# EAGLE design ESPswitch (EAGLE 9.3.0)
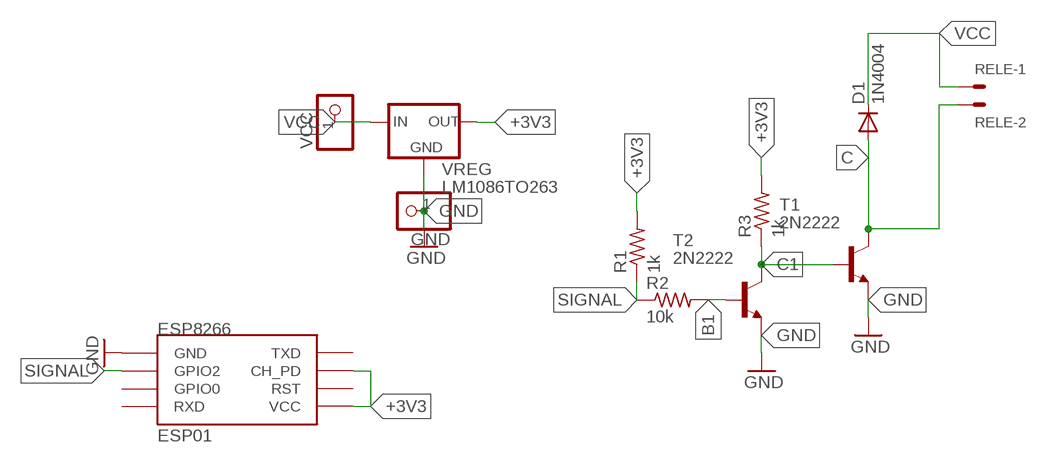
[diagram p0: schematic, sheet 1]

## Parts
D1  1N4004  [DO41-10]
ESP8266  ESP01  [ESP01]
GND  PINHD-1X1  [1X01]
R1  1k  R-US_0309/12  [0309/12]
R2  10k  R-US_0309/12  [0309/12]
R3  1k  R-US_0309/12  [0309/12]
RELE  22-23-2021  [22-23-2021]
T1  2N2222  [TO92-EBC-OVAL]
T2  2N2222  [TO92-EBC-OVAL]
VCC  PINHD-1X1  [1X01]
VREG  LM1086TO263  [TO263]

## Nets
+3V3: ESP8266.CH_PD ESP8266.VCC R1.2 R3.2 VREG.2(OUT)
B1: R2.2 T2.B
C: D1.A RELE.2 T1.C
C1: R3.1 T1.B T2.C
GND: ESP8266.GND GND.1 T1.E T2.E VREG.1(GND)
SIGNAL: ESP8266.GPIO2 R1.1 R2.1
VCC: D1.C RELE.1 VCC.1 VREG.3(IN)
Unconnected: ESP8266.GPIO0 ESP8266.RST ESP8266.RX(RXD) ESP8266.TX(TXD)

## Library data of the parts
D1 = adafruit:1N4004: DIODE General purpose 1N400x type rectifier (With bigger pads) http://www.ladyada.net/library/pcb/eaglelibrary.html
ESP8266 = esp8266modules:ESP01: ESP8266 Wifi module 01
GND VCC = adafruit:PINHD-1X1: Pin header 1x1 for 0.1" spacing With round pins
R1-R3 = rcl:R-US_: RESISTOR, American symbol; SPICEPREFIX: R
RELE = con-molex:22-23-2021: .100" (2.54mm) Center Header - 2 Pin; MF: MOLEX; MPN: 22-23-2021; OC_FARNELL: 1462926; OC_NEWARK: 25C3832
T1 T2 = adafruit:2N2222: NPN TRANSISTOR Big oval pads
VREG = v-reg-2:LM1086

## Board
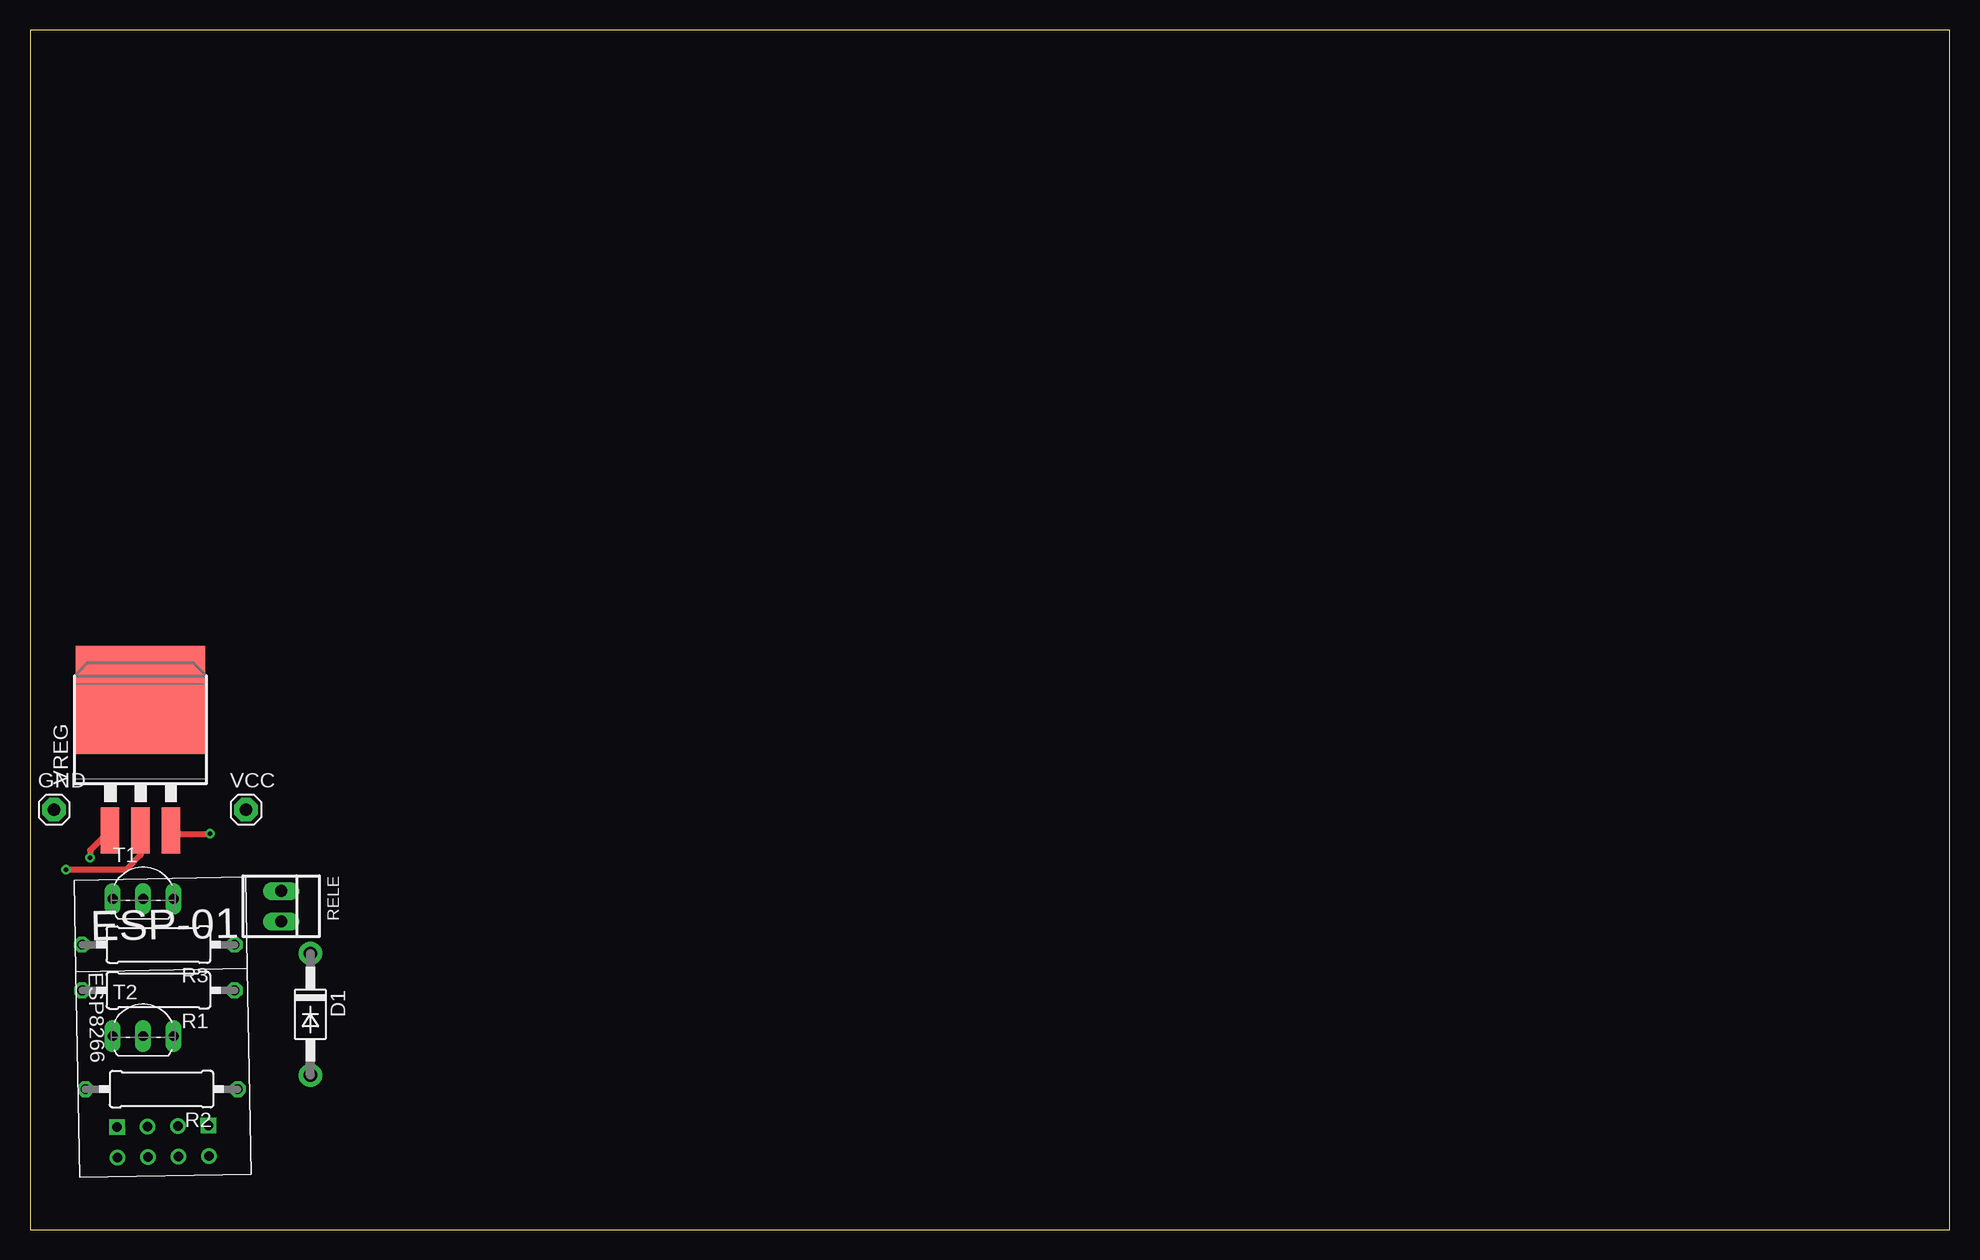
[diagram p1: board, top side]
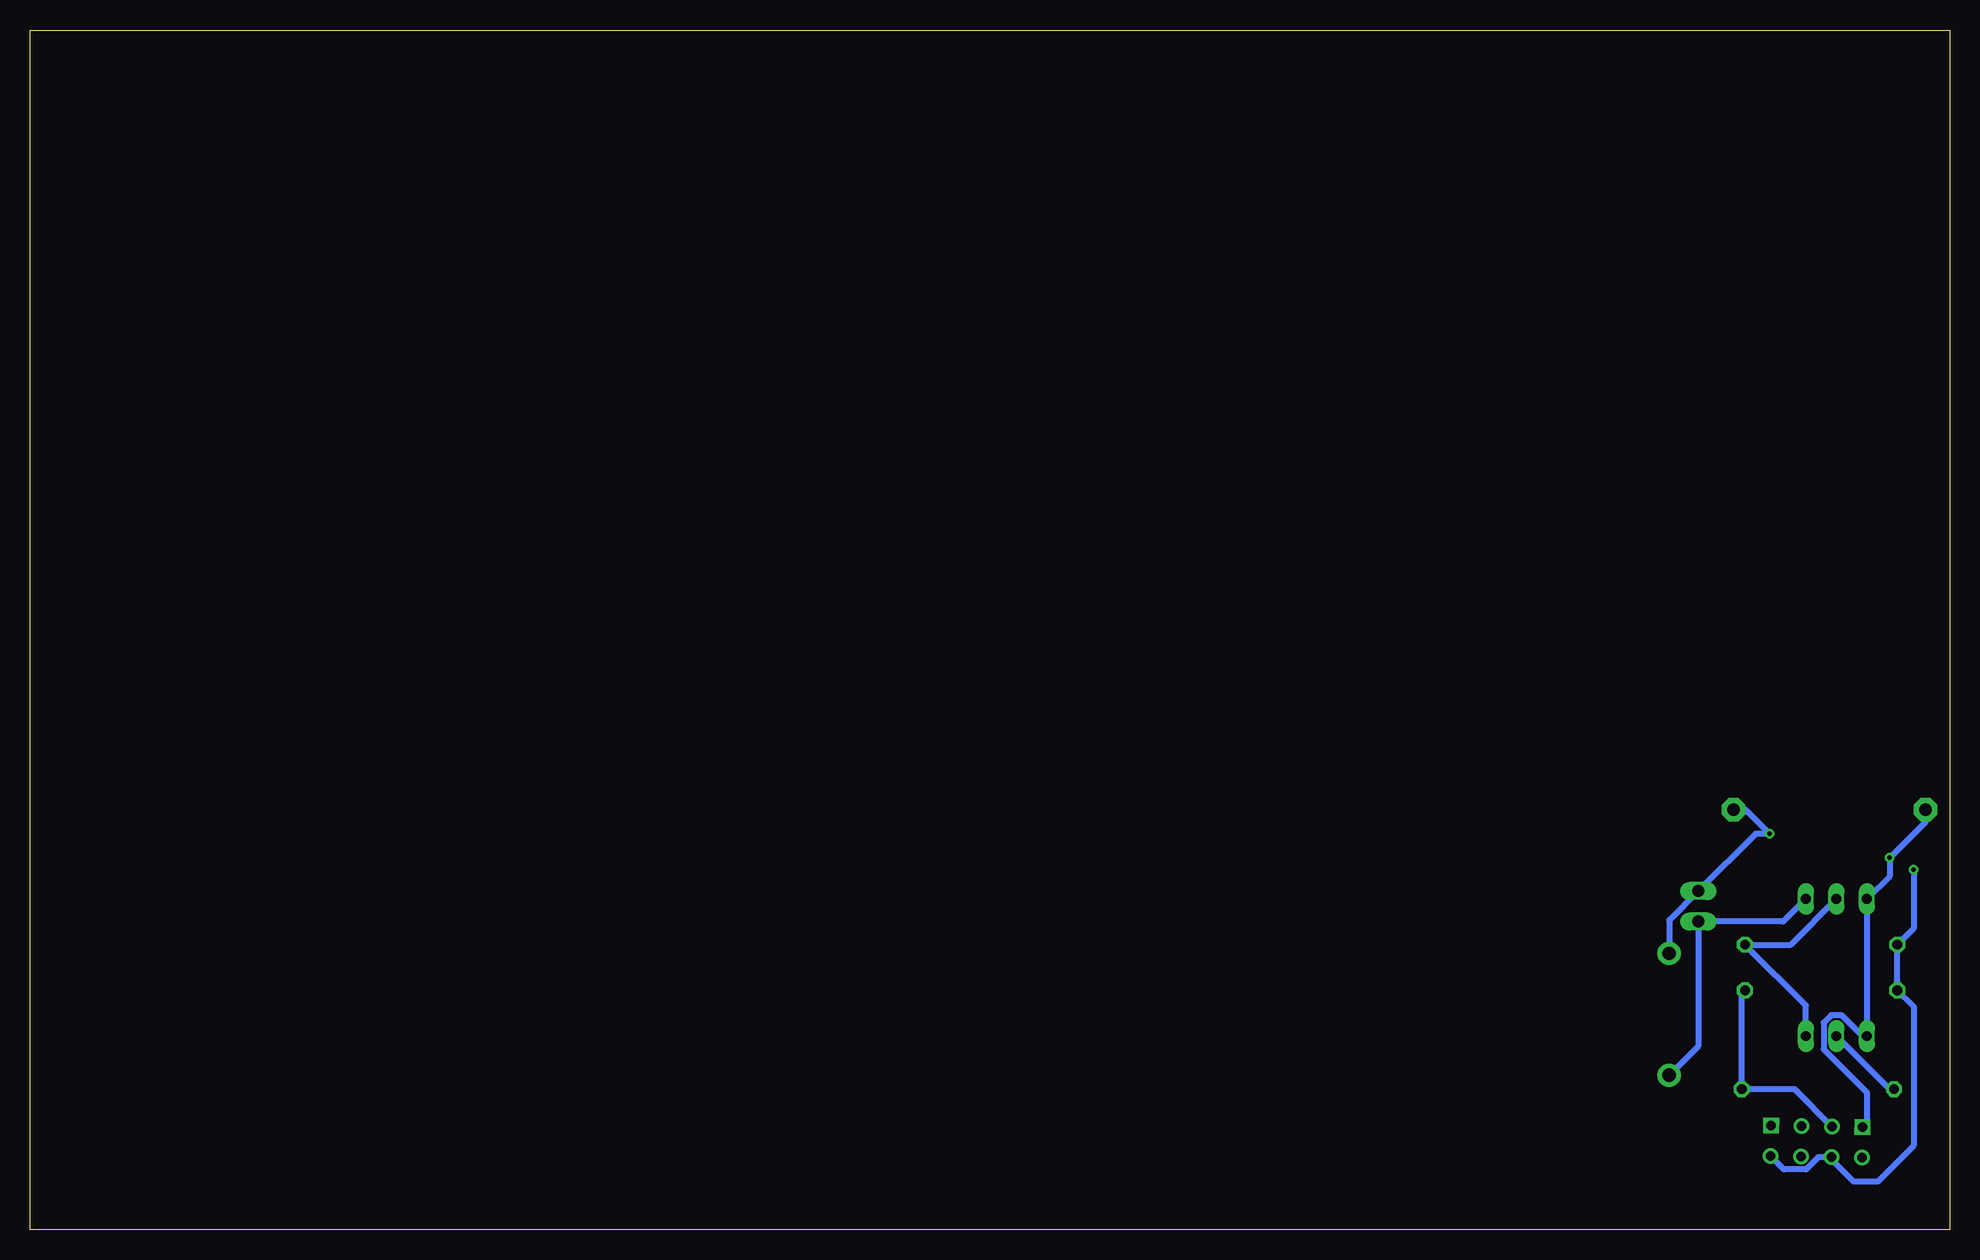
[diagram p2: board, bottom side, seen from below]

Size 160 x 100 mm. Coordinates in mm from the lower left corner, seen from the top.
Outline: 0,0 160,0 160,100 0,100 0,0
Copper layers (1*16): Top 0.035mm / dielectric 1.5mm / Bottom 0.035mm
Design rules "default": minimum track width 6mil, minimum drill 0.35mm, track to track 6mil, track to pad 6mil, pad to pad 6mil, via to via 6mil, smd to smd 6mil, copper to edge 40mil, drill to drill 6mil, minimum pad ring 10mil, minimum via ring 8mil, stop-mask expansion 4mil, vias tented up to drill 0mil, thermal gap 10mil

### Footprints (pad centres in the part's own frame; a part is rotated, then mirrored left to right if it is on the bottom)
DO41-10 = drill 1.118 pad 1.93: A 5.08,0; C -5.08,0
ESP01 = drill 0.8: CH_PD -1.285,-8.178; GPIO0 1.255,-5.638; GPIO2 -1.285,-5.638; RST 1.255,-8.178; TX -3.825,-8.178; VCC 3.795,-8.178 | drill 0.8 square: GND -3.825,-5.638; RX 3.795,-5.638
1X01 = drill 1.016 pad 1.93 octagon: 1 0,0
0309/12 = drill 0.813 octagon: 1 -6.35,0; 2 6.35,0
22-23-2021 = drill 1 long: 1 -1.27,0; 2 1.27,0
TO92-EBC-OVAL = drill 0.813 long: B 0,-1.27; C 2.54,-1.27; E -2.54,-1.27
TO263 = smd 1.524 x 3.81: 1 -2.54,-8.255; 2 0,-8.255; 3 2.54,-8.255 | smd 10.8 x 9: 4 0,2.635

### Placement (x,y rotation side)
D1  23.37,17.94 270 top
ESP8266  10.97,14.24 1.1 top
GND  2,35 0 top
R1  10.7,19.94 180 top
R2  10.97,11.7 180 top
R3  10.7,23.75 180 top
RELE  20.94,26.94 270 top
T1  9.43,28.83 0 top
T2  9.43,17.4 0 top
VCC  18,35 0 top
VREG  9.21,41.53 0 top

### Tracks (layer width: path | path; a pad name or v marks a point on that pad's centre or on a via)
+3V3  (via drill 0.35)
  Top 0.508: VREG.2 9.21,31.21 8,30 v3,30
  Bottom 0.508: ESP8266.VCC 13.8,5.02 11.94,5.02 10.92,6.04 ESP8266.CH_PD 9.84,5.84 8,4 6,4 3,7 3,18.59 R1.2 R3.2 3,25.1 v3,30
B1
  Bottom 0.508: R2.2 5,11.7 T2.B
C
  Bottom 0.508: T1.C 13.86,25.67 RELE.2 20.94,15.29 D1.A
C1
  Bottom 0.508: T2.C 11.97,18.67 R3.1 13.24,23.75 T1.B
GND  (via drill 0.35)
  Top 0.508: VREG.1 5,31.61 v5,31
  Bottom 0.508: ESP8266.GND 6.89,8.89 6.89,11.42 10.5,15.03 10.5,17.23 9.87,17.86 8.99,17.86 7.26,16.13 T2.E T1.E 5,29.45 v5,31 2,34 GND.1
SIGNAL
  Bottom 0.508: ESP8266.GPIO2 12.91,11.7 R2.1 17.32,19.67 R1.1
VCC  (via drill 0.35)
  Top 0.508: VREG.3 12.03,33 v15,33
  Bottom 0.508: D1.C 23.37,25.78 RELE.1 16.15,33 v15,33 17,35 VCC.1